# EasyEDA Pro project ProProject_NFC_SJTU-电院版本-CUID.epro

# Schematic schematic1
Create Date: 2023-11-20; Page Name: P1; Project Name: NFC_SJTU-电院版本-CUID-V5.0; Schematic Name: schematic1; Update Date: 2023-11-20; Company: 嘉立创EDA; Page Size: A4; Version: V1.0
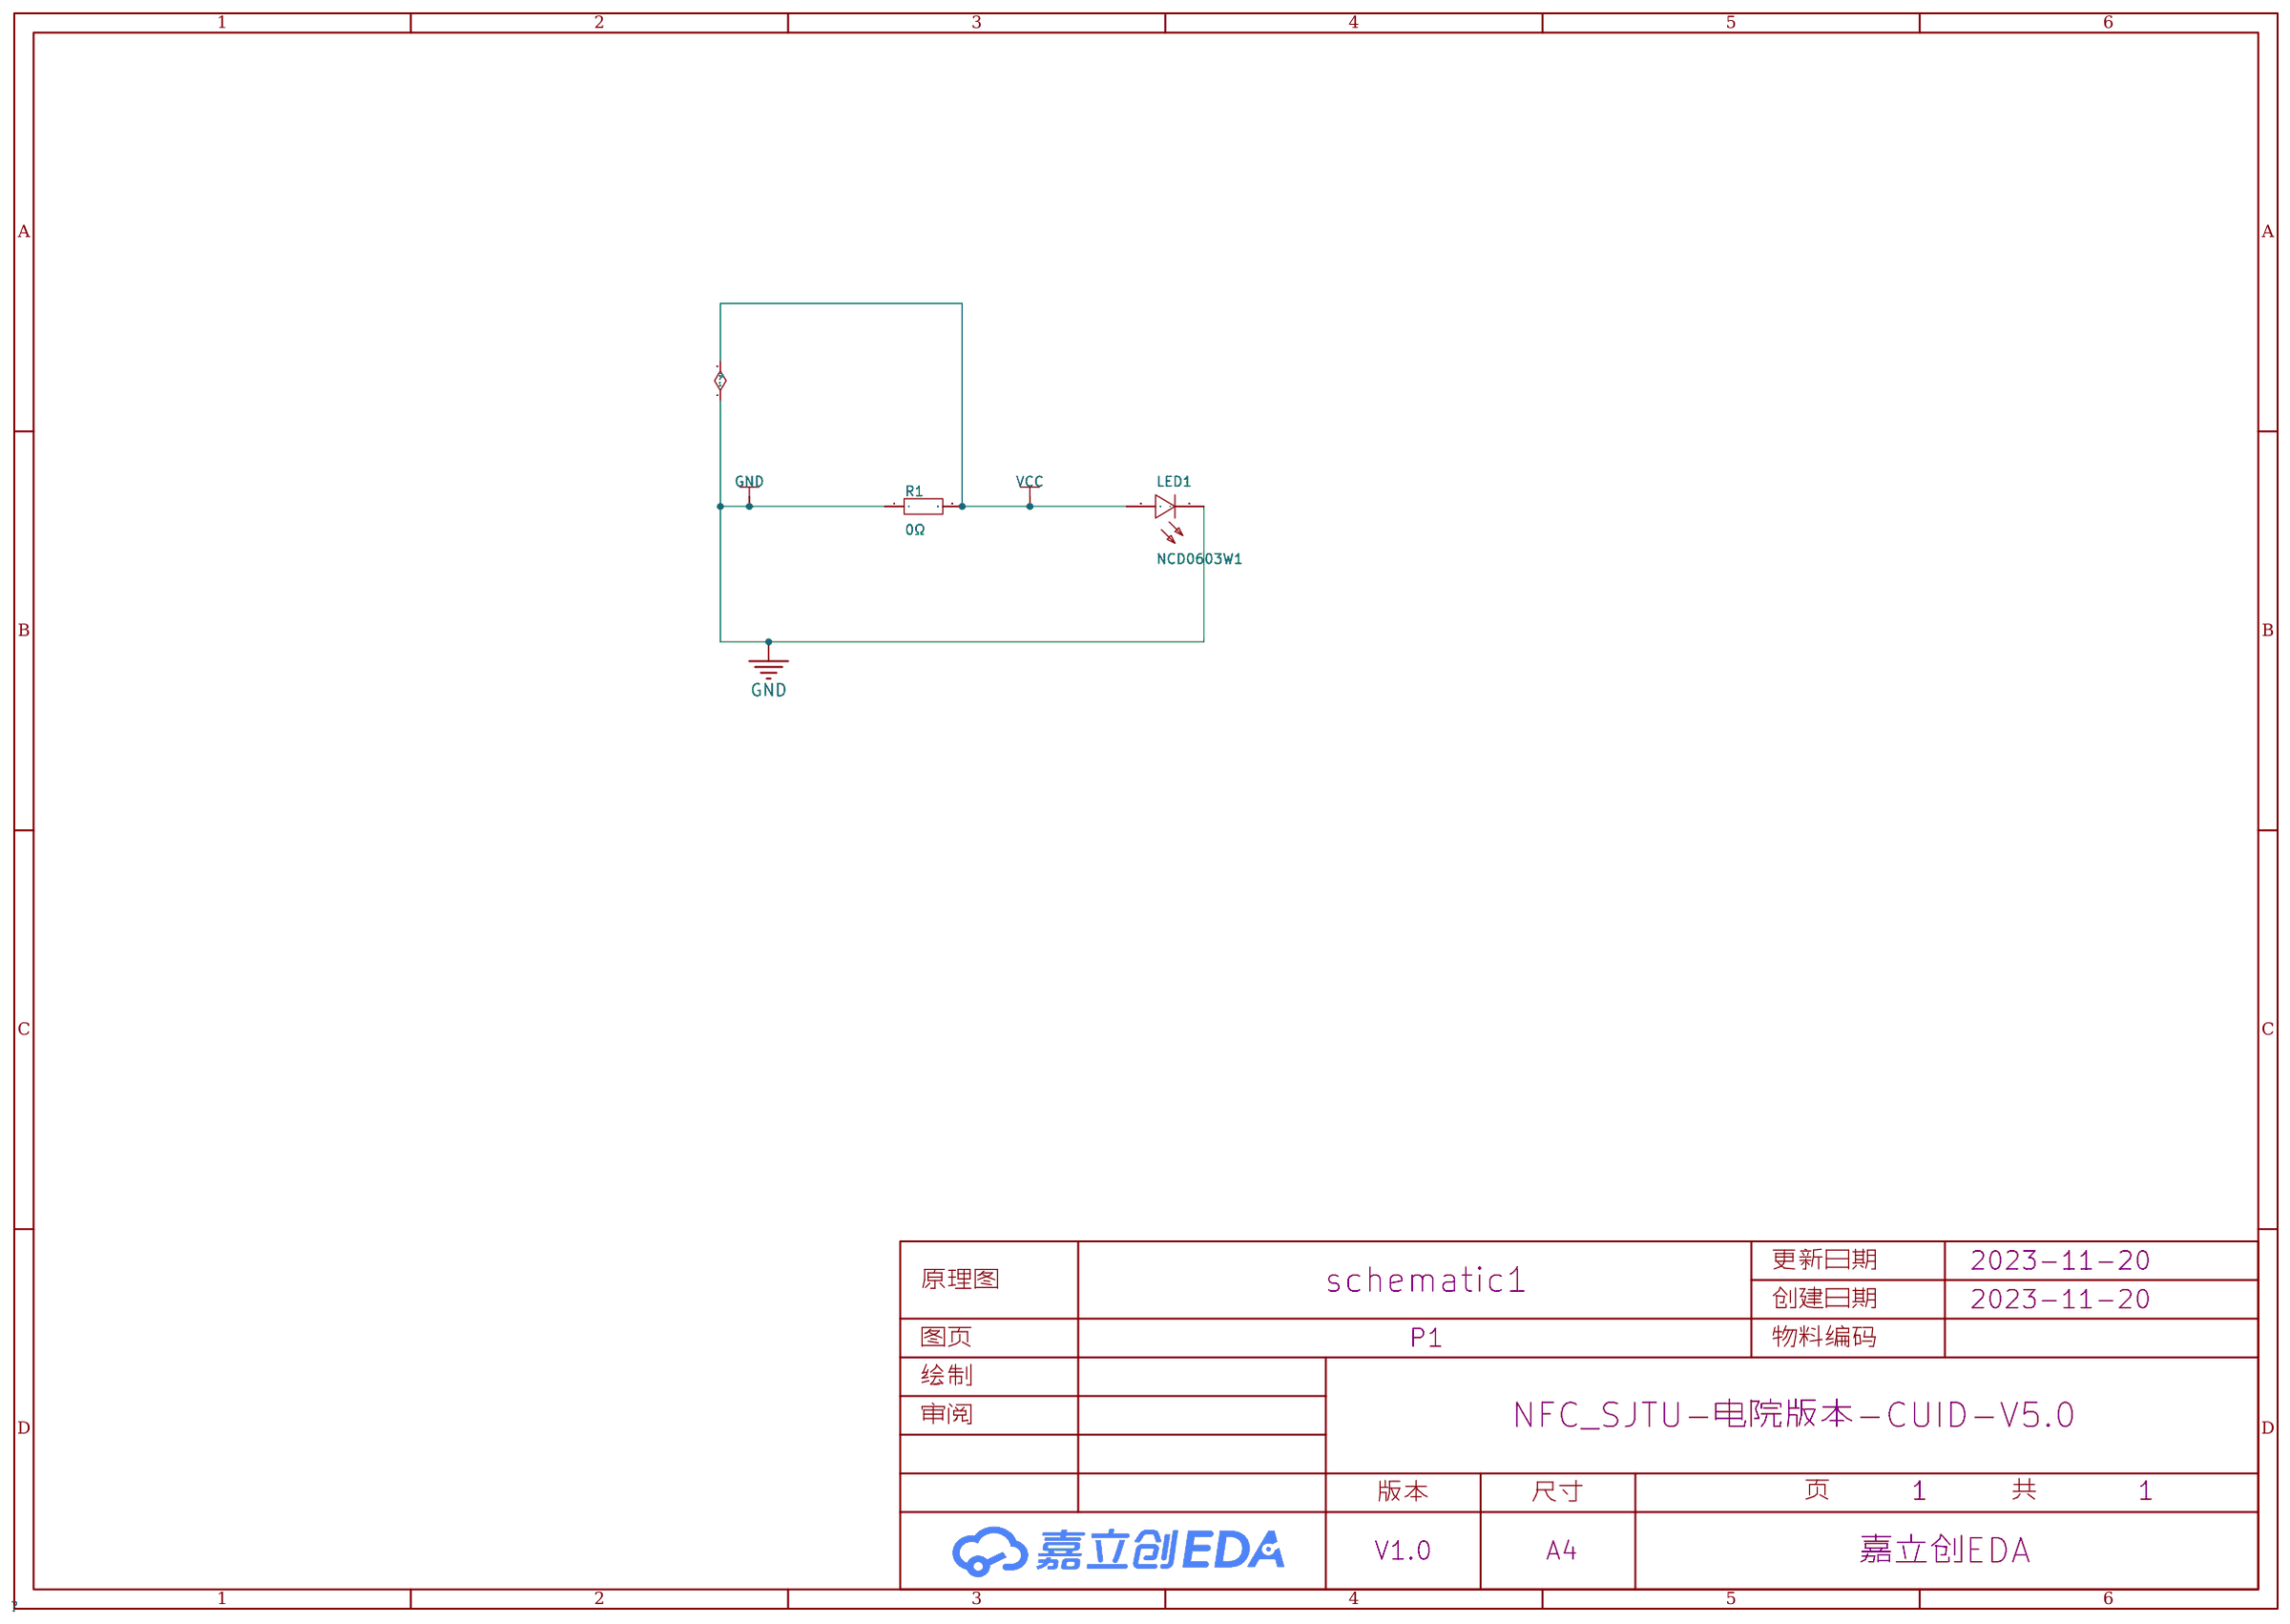
[diagram p0: schematic sheet]

## Parts
LED1  NCD0603W1  [LED0603-RD]
R1  0Ω  [R1812]

## Library data of the parts
LED1 = NCD0603W1: 发光颜色:白灯;; Supplier Part: C84265; Manufacturer: 国星光电; Supplier Footprint: 0603; Datasheet: https://atta.szlcsc.com/upload/public/pdf/source/20200820/C84265_479E6193713348A548E5CD6D9278BF16.pdf; Supplier: LCSC; Emitted Color: 白灯
R1 = 181207J0000T4E: 电阻类型:厚膜电阻;阻值:0Ω;精度:±5%;功率:750mW;温度系数:±800ppm/℃;; LCSC Part Name: 厚膜电阻 0Ω ±5% 750mW; Supplier Part: C270976; Manufacturer: UNI-ROYAL(厚声); Supplier Footprint: 1812; Datasheet: https://atta.szlcsc.com/upload/public/pdf/source/20200306/C422600_1E6D84923E4A46A82E41ADD87F860B5C.pdf; Supplier: LCSC; Type: 厚膜电阻; Tolerance: ±5%; Power(Watts): 750mW; Temperature Coefficient: ±800ppm/℃; Overload Voltage (Max): 200V; Operating Temperature Range: -55℃~+155℃

## Nets
GND: LED1.1(-) LED1.2(+) R1.1 R1.2

# Board PCB2
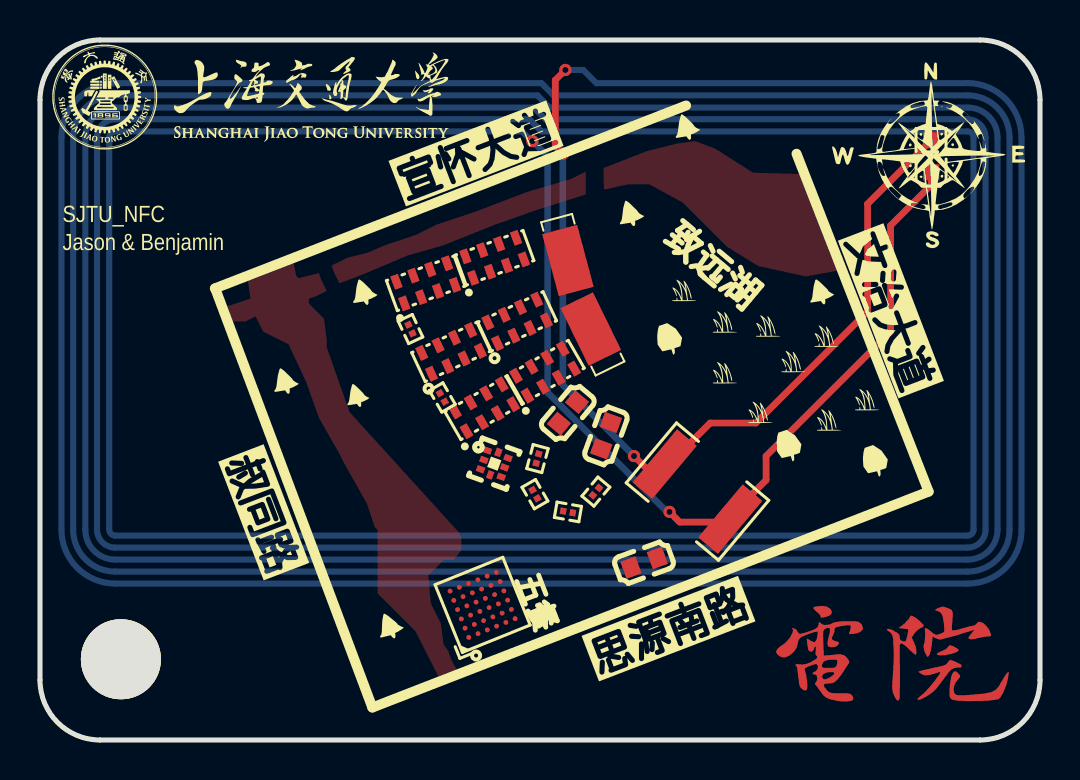
[diagram p1: board, top side]
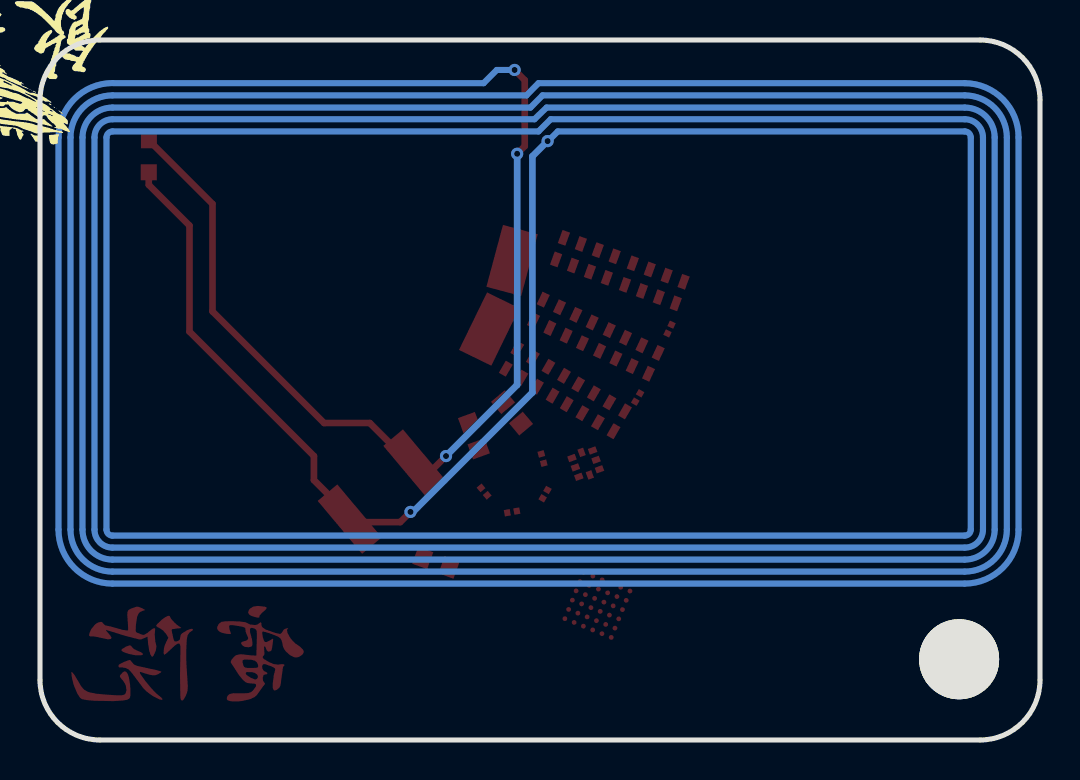
[diagram p2: board, bottom side, seen from below]

Outline 50 x 35 mm; copper layers: Top Layer, Bottom Layer. Coordinates in mm from the lower left corner of the outline.
Outline path: 0,32 0,3 arc(0.88,0.88) 3,0 47,0 arc(49.12,0.88) 50,3 50,32 arc(49.12,34.12) 47,35 3,35 arc(0.88,34.12) 0,32
Stack: Top Layer 0.035mm / Dielectric1 1.51mm FR4 er 4.5 / Bottom Layer 0.035mm

## Design rules (mm)
template: JLCPCB Capability(Two Layers Board)
spacing copperThickness1oz (default): track to track 0.102, other pairs 0.152 to 0.3
spacing copperThickness2oz: track to track 0.203, other pairs 0.152 to 0.3
track width copperThickness1oz (default): min 0.127, default 0.254, max 2.54
track width copperThickness2oz: min 0.203, default 0.254, max 2.54
differential pair differentialPair (default): width min 0.127, default 0.254, max 2.54; gap min 0.152, default 0.152
via viaSize (default): diameter min 0.5, default 0.61, max 10; hole min 0.3, default 0.305, max 6.3

## Placement (name value [footprint] x y rotation side)
C1  -  [C0603]  28.3 15.21 70 top
C1#2  -  [C0603]  30.21 8.86 20 top
C1#3  -  [C0603]  26.4 16.36 50 top
LED1  NCD0603W1  [LED0603-RD]  44.56 29.18 90 top
NOREF  -  [Pad_e8]  4.04 4.04 0 top
R1  0Ω  [R1812]  32.87 12.42 140 top
R2  -  [R0201]  18.52 20.55 115 top
R2#2  -  [R0201]  27.79 12.42 50 top
R2#3  -  [R0201]  20.12 17.13 120 top
R2#4  -  [R0201]  24.87 14.07 75 top
R2#5  -  [R0201]  24.75 12.29 120 top
R2#6  -  [R0201]  26.4 11.4 170 top
U1  -  [LCC-8_L3.2-W1.5-P0.90-BL]  22.73 24.11 20 top
U1#2  -  [LCC-8_L3.2-W1.5-P0.90-BL]  19.28 22.83 20 top
U1#3  -  [LCC-8_L3.2-W1.5-P0.90-BL]  23.86 20.93 25 top
U1#4  -  [LCC-8_L3.2-W1.5-P0.90-BL]  20.56 19.41 25 top
U1#5  -  [LCC-8_L3.2-W1.5-P0.90-BL#2]  22.21 16.61 30 top
U1#6  -  [LCC-8_L3.2-W1.5-P0.90-BL#2]  25.25 18.39 30 top
U9  -  [BGA-36_L3.5-W3.5-R6-R6-P0.50-BL]  21.95 6.83 22 top
U13  -  [ANT-SMD_MUPS1101-3H]  26.4 23.98 285 top
U13#2  -  [ANT-SMD_MUPS1101-3H]  27.54 20.55 116 top
U14  NT3H2211W0FHKH  [XQFN-8_L1.6-W1.6-P0.50-TL]  22.71 13.82 340 top

## Footprints (pads in the part's own frame, mm; a bottom-side part is the same pattern mirrored in y, then rotated)
ANT-SMD_MUPS1101-3H
  rect 3.2x1.8 smd: 1(0,0)
BGA-36_L3.5-W3.5-R6-R6-P0.50-BL
  round 0.24 smd: A1(-1.113,-1.387) A2(-1.113,-0.886) A3(-1.113,-0.387) A4(-1.113,0.114) A5(-1.113,0.614) A6(-1.113,1.113) B1(-0.614,-1.387) B2(-0.614,-0.886) B3(-0.614,-0.387) B4(-0.614,0.114) B5(-0.614,0.614) B6(-0.614,1.113) C1(-0.114,-1.387) C2(-0.114,-0.886) C3(-0.114,-0.387) C4(-0.114,0.114) C5(-0.114,0.614) C6(-0.114,1.113) D1(0.387,-1.387) D2(0.387,-0.886) D3(0.387,-0.387) D4(0.387,0.114) D5(0.387,0.614) D6(0.387,1.113) E1(0.886,-1.387) E2(0.886,-0.886) E3(0.886,-0.387) E4(0.886,0.114) E5(0.886,0.614) E6(0.886,1.113) F1(1.387,-1.386) F2(1.387,-0.886) F3(1.387,-0.387) F4(1.387,0.113) F5(1.387,0.614) F6(1.387,1.113)
C0603
  rect 0.8x0.9 smd: 1(-0.7,0) 2(0.7,0)
LCC-8_L3.2-W1.5-P0.90-BL
  rect 0.4x0.697 smd: 1(-1.35,-0.574) 2(-0.45,-0.574) 3(0.45,-0.574) 4(1.35,-0.574) 5(1.35,0.574) 6(0.45,0.574) 7(-0.45,0.574) 8(-1.35,0.574)
LCC-8_L3.2-W1.5-P0.90-BL#2
  rect 0.4x0.697 smd: 1(-1.35,-0.574) 2(-0.45,-0.574) 3(0.45,-0.574) 4(1.35,-0.574) 5(1.35,0.574) 6(0.45,0.574) 7(-0.45,0.574) 8(-1.35,0.574)
LED0603-RD
  rect 0.8x0.8 smd: 1(-0.799,-0.004) 2(0.799,0.004)
Pad_e8
  round 4 hole 4: 1(0,0)
R0201
  rect 0.303x0.324 smd: 1(-0.241,0) 2(0.241,0)
R1812
  rect 1.282x3.456 smd: 1(-2.141,0) 2(2.141,0)
XQFN-8_L1.6-W1.6-P0.50-TL
  rect 0.4x0.3 smd: 1(-0.55,0.5) 2(-0.55,0) 3(-0.55,-0.5) 5(0.55,-0.5) 6(0.55,0) 7(0.55,0.5)
  rect 0.3x0.4 smd: 4(0,-0.6) 8(0,0.6)

## Nets
As in the schematic.

Pads without a net: C1 1 2; C1#2 1 2; C1#3 1 2; NOREF 1; R2 1 2; R2#2 1 2; R2#3 1 2; R2#4 1 2; R2#5 1 2; R2#6 1 2; U1 1 2 3 4 5 6 7 8; U1#2 1 2 3 4 5 6 7 8; U1#3 1 2 3 4 5 6 7 8; U1#4 1 2 3 4 5 6 7 8; U1#5 1 2 3 4 5 6 7 8; U1#6 1 2 3 4 5 6 7 8; U9 A1 A2 A3 A4 A5 A6 B1 B2 B3 B4 B5 B6 C1 C2 C3 C4 C5 C6 D1 D2 D3 D4 D5 D6 E1 E2 E3 E4 E5 E6 F1 F2 F3 F4 F5 F6; U13 1; U13#2 1; U14 1 2 3 4 5 6 7 8

## Via types
v1: diameter 0.61, hole 0.305, Top Layer to Bottom Layer, 5 vias

## Routing (per net, layer and track width the routed paths; a pad name or vN(x,y) marks a point on that pad's centre or on a via; arc(x,y) is an arc through that point)
GND: length 761.2
  Top Layer w0.33: v1(26.14,29.31) 25.76,29.69 25.76,32.99 v1(26.27,33.5) ; R1.2 31.46,13.8 33.51,15.85 35.79,15.85 41.38,21.43 41.38,26.81 LED1.2 ; LED1.1 44.56,27.76 42.53,25.72 42.53,20.42 36.3,14.2 36.3,12.99 34.51,11.2 R1.1 ; v1(29.7,14.2) 30.72,13.18 ; 34.64,10.92 34.62,10.9 31.99,10.9 v1(31.48,11.4)
  Bottom Layer w0.254: v1(24.62,29.95) 24.48,30.09 24.45,30.09
  Bottom Layer w0.305: 49.08,30.12 49.08,10.52 arc(48.29,8.61) 46.38,7.82 3.77,7.82 arc(1.86,8.61) 1.07,10.52 1.07,30.12 arc(1.86,32.04) 3.77,32.84 25.08,32.84 25.68,32.23 46.38,32.23 arc(47.86,31.61) 48.48,30.12 48.48,10.52 arc(47.86,9.03) 46.38,8.42 3.77,8.42 arc(2.28,9.03) 1.66,10.52 1.66,30.12 arc(2.27,31.61) 3.77,32.23 24.87,32.23 25.48,31.62 46.38,31.62 arc(47.44,31.18) 47.88,30.12 47.88,10.52 arc(47.44,9.46) 46.38,9.02 3.77,9.02 arc(2.71,9.46) 2.27,10.52 2.27,30.12 arc(2.71,31.18) 3.77,31.62 24.67,31.62 25.28,31.04 46.38,31.04 arc(47.02,30.77) 47.28,30.12 47.28,10.52 arc(47.01,9.88) 46.38,9.62 3.77,9.62 arc(3.12,9.88) 2.85,10.52 2.85,30.12 arc(3.12,30.77) 3.77,31.04 24.47,31.04 25.08,30.43 46.38,30.43 arc(46.59,30.34) 46.68,30.12 46.68,10.52 arc(46.59,10.31) 46.38,10.22 3.77,10.22 arc(3.55,10.31) 3.46,10.52 3.46,30.12 arc(3.55,30.34) 3.77,30.43 24.11,30.43 24.45,30.09 ; 46.33,32.84 27.82,32.84 27.16,33.5 v1(26.27,33.5) ; 49.07,30.13 arc(48.28,32.05) 46.37,32.85
  Bottom Layer w0.33: v1(24.62,29.95) 25.38,29.18 25.38,17.37 31.35,11.4 v1(31.48,11.4) ; v1(26.14,29.31) 26.14,17.75 v1(29.7,14.2)

## Copper pours and planes (outline as drawn; the poured copper is in the pictures)
(no net) on Top Layer: 14.59,28.42 27.29,28.42 27.29,22.83 14.59,22.83
(no net) on Top Layer: 28.18,29.95 39.86,29.95 39.86,23.18 28.18,23.18
(no net) on Top Layer: 9.38,23.85 21.06,23.85 21.06,3.18 9.38,3.18

Small or netless copper shapes (teardrops, artwork), in the pictures only: 8 on Top Layer

## Text on the board
Top Silkscreen Layer: SJTU_NFC / Jason & Benjamin | 五餐 | 致远湖 | 宣怀大道 | 思源南路 | 叔同路 | 文治大道
